# Altium project PCB_Project.PrjPcb
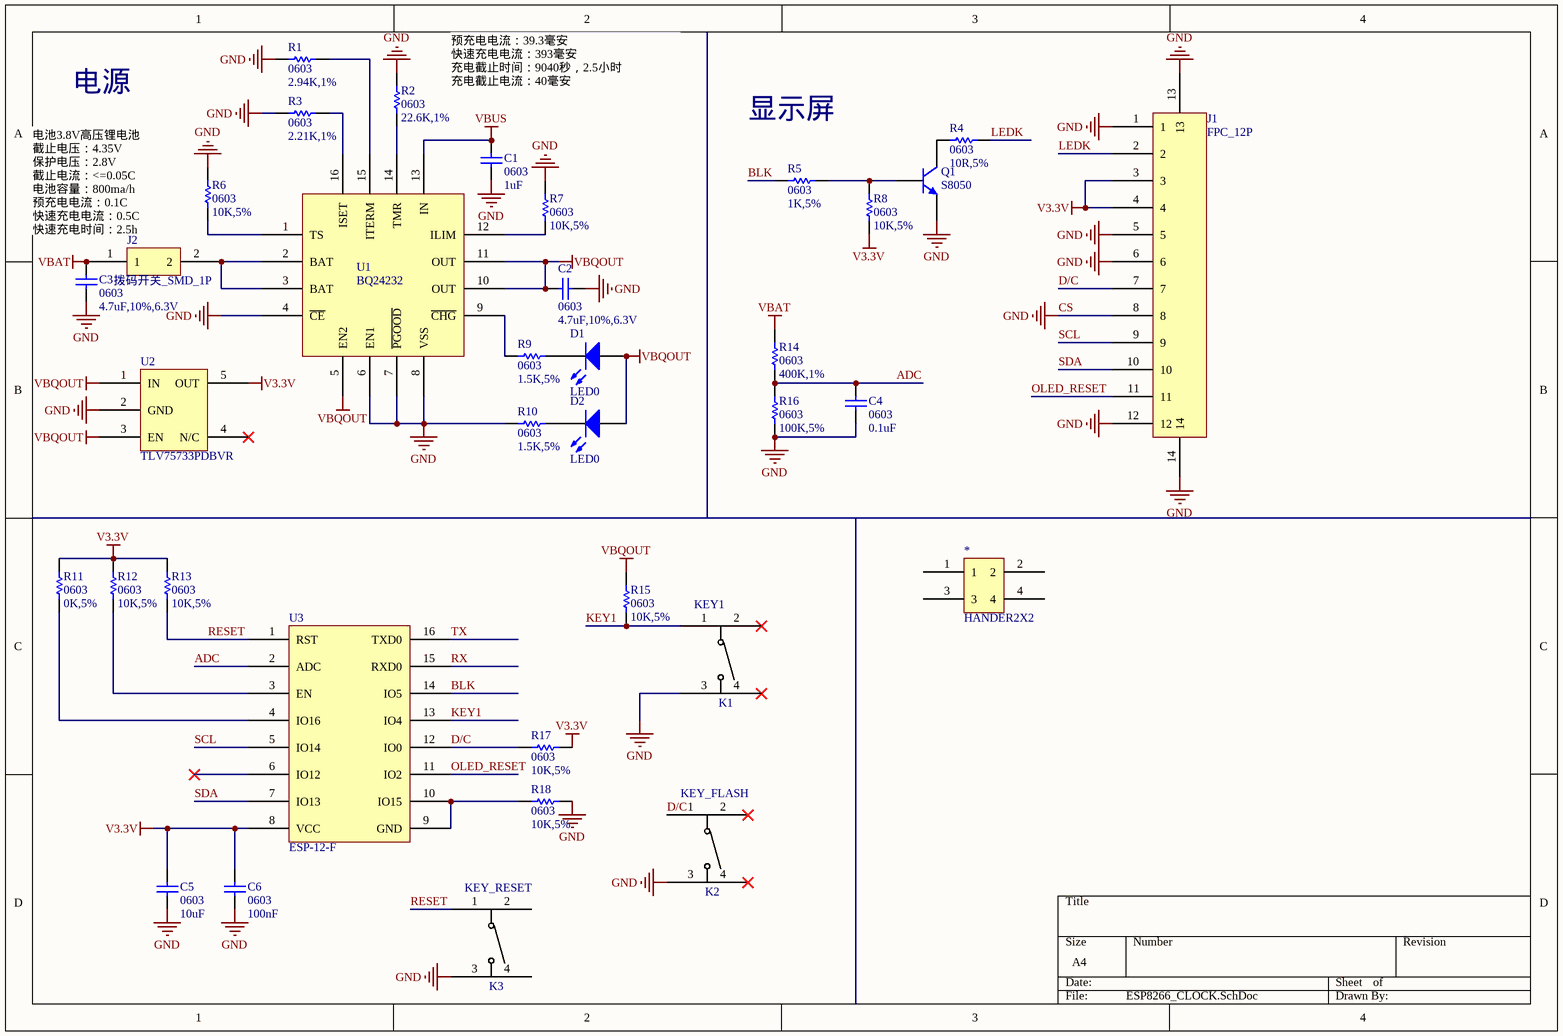
[diagram p0: ESP8266_CLOCK.SchDoc]
1 sheet, 36 parts. Net scope: global (net labels, ports and power ports of the same name join across sheets).
Board file: ESP8266_COLOCK.PcbDoc

## Sheet ESP8266_CLOCK.SchDoc
size A4; SheetNumber: 1; SheetTotal: 1

### Parts
*  HANDER2X2
C1  0603  value 1uF  [RAD-0.3]
C2  0603  value 4.7uF,10%,6.3V  [RAD-0.3]
C3  0603  value 4.7uF,10%,6.3V  [RAD-0.3]
C4  0603  value 0.1uF  [RAD-0.3]
C5  0603  value 10uF  [RAD-0.3]
C6  0603  value 100nF  [RAD-0.3]
D1  LED0  [LED-0]
D2  LED0  [LED-0]
J1  FPC_12P
J2  拨码开关_SMD_1P
K1  KEY1
K2  KEY_FLASH
K3  KEY_RESET
Q1  S8050  [TO-226-AA]
R1  0603  value 2.94K,1%  [AXIAL-0.3]
R2  0603  value 22.6K,1%  [AXIAL-0.3]
R3  0603  value 2.21K,1%  [AXIAL-0.3]
R4  0603  value 10R,5%  [AXIAL-0.3]
R5  0603  value 1K,5%  [AXIAL-0.3]
R6  0603  value 10K,5%  [AXIAL-0.3]
R7  0603  value 10K,5%  [AXIAL-0.3]
R8  0603  value 10K,5%  [AXIAL-0.3]
R9  0603  value 1.5K,5%  [AXIAL-0.3]
R10  0603  value 1.5K,5%  [AXIAL-0.3]
R11  0603  value 0K,5%  [AXIAL-0.3]
R12  0603  value 10K,5%  [AXIAL-0.3]
R13  0603  value 10K,5%  [AXIAL-0.3]
R14  0603  value 400K,1%  [AXIAL-0.3]
R15  0603  value 10K,5%  [AXIAL-0.3]
R16  0603  value 100K,5%  [AXIAL-0.3]
R17  0603  value 10K,5%  [AXIAL-0.3]
R18  0603  value 10K,5%  [AXIAL-0.3]
U1  BQ24232  [BQ24232]
U2  TLV75733PDBVR
U3  ESP-12-F

### Nets
CS: C1.1 C2.1 C3.2 C4.1 C5.1 C6.1 J1.1 J1.5 J1.6 J1.8 J1.12 J1.13 J1.14 K1.3 K2.3 K3.3 Q1.3(E) R1.2 R2.2 R3.2 R6.1 R7.2 R10.2 R16.2 R18.1 U1.4(~{CE}) U1.6(EN1) U1.7(~{PGOOD}) U1.8(VSS) U2.2(GND)  [also labelled GND]
V3.3V: C5.2 C6.2 J1.3 J1.4 R8.1 R11.2 R12.1 R13.2 R17.1 U2.5(OUT) U3.8(VCC)
VBAT: C3.1 J2.1 R14.1
VBQOUT: C2.2 D1.1(A) D2.1(A) R15.1 U1.5(EN2) U1.10(OUT) U1.11(OUT) U2.1(IN) U2.3(EN)
VBUS: C1.2 U1.13(IN)
ADC: C4.2 R14.2 R16.1 U3.2(ADC)
BLK: R5.2 U3.14(IO5)
D/C: J1.7 K2.1 R17.2 U3.12(IO0)
KEY1: K1.1 R15.2 U3.13(IO4)
LEDK: J1.2 R4.1
OLED_RESET: J1.11 U3.11(IO2)
RESET: K3.1 R13.1 U3.1(RST)
RX: U3.15(RXD0)
SCL: J1.9 U3.5(IO14)
SDA: J1.10 U3.7(IO13)
TX: U3.16(TXD0)
NetD1_2: D1.2(K) R9.1
NetD2_2: D2.2(K) R10.1
NetJ2_2: J2.2 U1.2(BAT) U1.3(BAT)
NetQ1_1: Q1.1(C) R4.2
NetQ1_2: Q1.2(B) R5.1 R8.2
NetR1_1: R1.1 U1.15(ITERM)
NetR2_1: R2.1 U1.14(TMR)
NetR3_1: R3.1 U1.16(ISET)
NetR6_2: R6.2 U1.1(TS)
NetR7_1: R7.1 U1.12(ILIM)
NetR9_2: R9.2 U1.9(~{CHG})
NetR11_1: R11.1 U3.4(IO16)
NetR12_2: R12.2 U3.3(EN)
NetR18_2: R18.2 U3.9(GND) U3.10(IO15)

Not connected (* = marked no-connect by the designer): * 1 2 3 4; K1 2* 4*; K2 2* 4*; K3 2 4; U2 4(N/C)*; U3 6(IO12)*

### Notes on the sheet
- 电源
- 预充电电流：39.3毫安
  快速充电电流：393毫安
  充电截止时间：9040秒，2.5小时
  充电截止电流：40毫安
- 显示屏
- 电池3.8V高压锂电池
  截止电压：4.35V
  保护电压：2.8V
  截止电流：<=0.05C
  电池容量：800ma/h
  预充电电流：0.1C
  快速充电电流：0.5C
  快速充电时间：2.5h

### Library data of the parts
* = HANDER2X2: 2*2排母弯插
C1-C6 = Cap: Capacitor; Published: 8-Jun-2000; LatestRevisionDate: 17-Jul-2002; LatestRevisionNote: Re-released for DXP Platform.; PackageReference: RAD-0.3; Publisher: Altium Limited; PackageDescription: Radial Cap, Thru-Hole; 2 Leads; 0.3 in Pin Spacing
D1 D2 = LED0: Typical INFRARED GaAs LED; Published: 8-Jun-2000; LatestRevisionDate: 08-Jul-2005; LatestRevisionNote: Mech Layer 1 removed.; PackageReference: LED-0; Publisher: Altium Limited; PackageDescription: LED; 2 Leads
J1 = FPC_12P: FPC 0.5mm间距 12P 下接式
K1-K3 = KEY_4PIN: 乌龟按键; ComponentLink1Description: 采购链接; ComponentLink1URL: https://item.szlcsc.com/617095.html
Q1 = NPN: NPN Bipolar Transistor; Published: 8-Jun-2000; LatestRevisionDate: 17-Jul-2002; LatestRevisionNote: Re-released for DXP Platform.; PackageReference: TO-226-AA; Publisher: Altium Limited; PackageDescription: TO, Flat Index; 3 In-Line, Axial Leads; Body Dia. 4.8mm; Leads 0.55 x 0.51 mm (max); Code_JEDEC: TO-226-AA
R1-R18 = Res1: Resistor; Published: 8-Jun-2000; LatestRevisionDate: 17-Jul-2002; LatestRevisionNote: Re-released for DXP Platform.; PackageReference: AXIAL-0.3; Publisher: Altium Limited; PackageDescription: Axial Device, Thru-Hole; 2 Leads; 0.3 in Pin Spacing
U1 = BQ24232: 电池管理芯片; ComponentLink1Description: 数据手册; ComponentLink1URL: https://www.ti.com/cn/lit/gpn/bq24232h; ComponentLink2Description: 采购链接; ComponentLink2URL: https://item.szlcsc.com/602144.html
U2 = TLV75733PDBVR: 低压差稳压芯片，1A; ComponentLink1Description: 数据手册; ComponentLink1URL: https://www.ti.com/cn/lit/ds/symlink/tps7a20.pdf?ts=1676462131252&ref_url=https%253A%252F%252Fso.szlcsc.com%252F
U3 = ESP-12-F: 安信可ESP8266模组; ComponentLink1Description: New link; ComponentLink1URL: *